# EAGLE design breadboarddev (EAGLE 7.4.0)
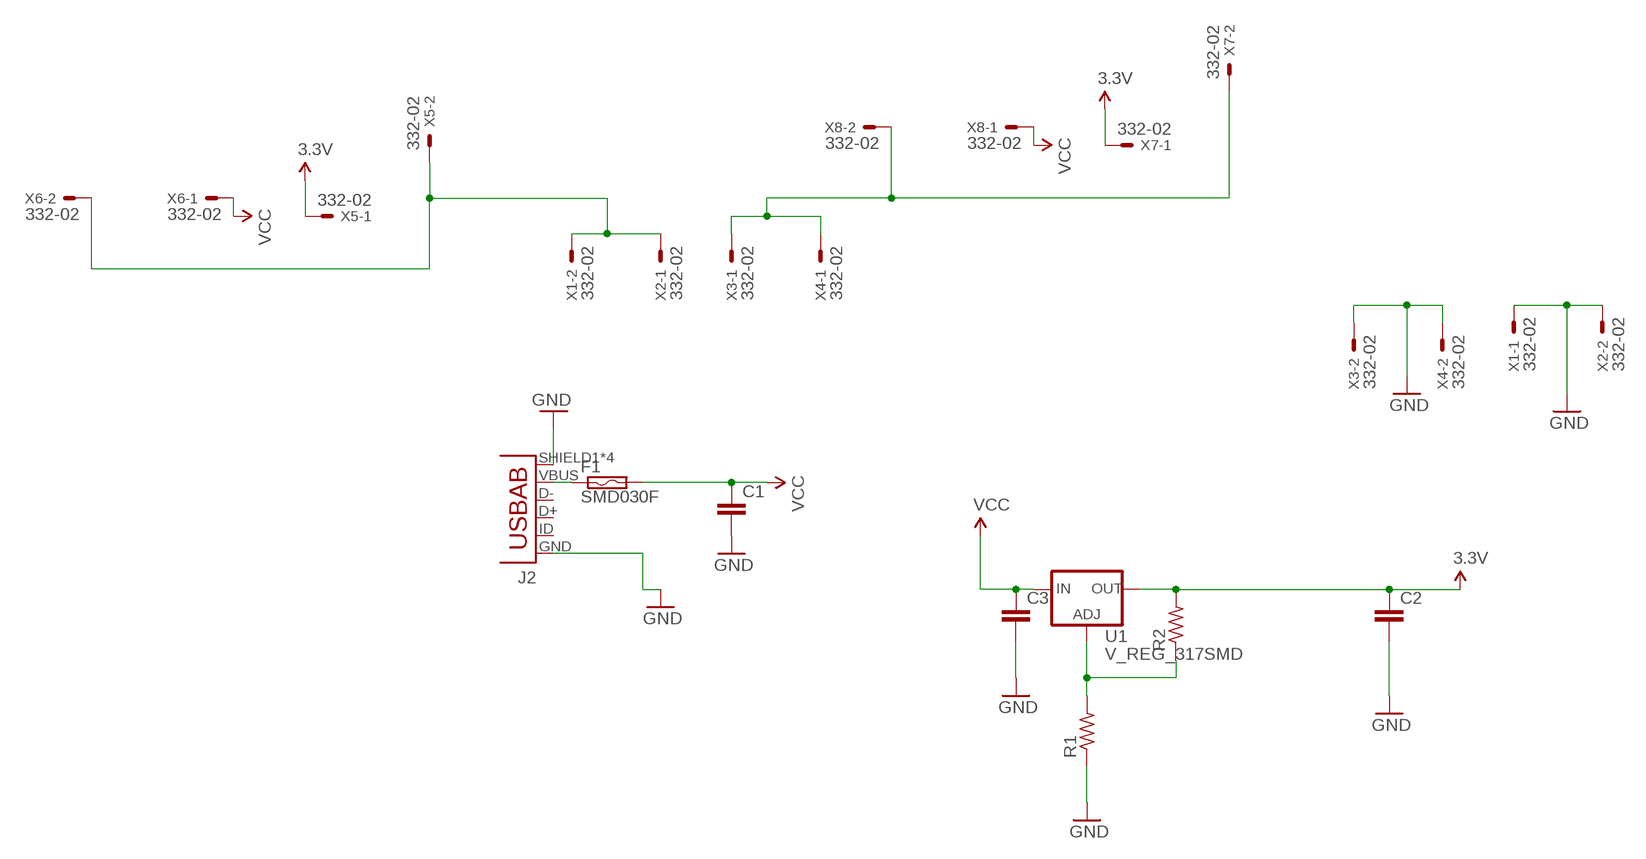
[diagram p0: schematic, sheet 1]

## Parts
C1  C-EUC0603K  [C0603K]
C2  C-EUC0603K  [C0603K]
C3  C-EUC0603K  [C0603K]
F1  SMD030F  [SMD050F]
J2  USB-AB  [USB-AB-MICRO-SMD]
R1  R-US_MELF0204W  [MINI_MELF-0204W]
R2  R-US_MELF0204W  [MINI_MELF-0204W]
U1  V_REG_317SMD  [SOT223]
X1  332-02  [332-02]
X2  332-02  [332-02]
X3  332-02  [332-02]
X4  332-02  [332-02]
X5  332-02  [332-02]
X6  332-02  [332-02]
X7  332-02  [332-02]
X8  332-02  [332-02]

## Nets
3.3V: C2.1 R2.2 U1.2(OUT) X5.1 X7.1
GND: C1.2 C2.2 C3.2 J2.GND J2.SHIELD1(SHIELD) J2.SHIELD2(SHIELD) J2.SHIELD3(SHIELD) J2.SHIELD4(SHIELD) R1.1 X1.1 X2.2 X3.2 X4.2
N$1: R1.2 R2.1 U1.1(ADJ)
N$2: X1.2 X2.1 X5.2 X6.2
N$3: F1.1 J2.VBUS
N$4: X3.1 X4.1 X7.2 X8.2
VCC: C1.1 C3.1 F1.2 U1.3(IN) X6.1 X8.1
Unconnected: J2.D+ J2.D- J2.ID(USBID)

## Library data of the parts
C1-C3 = rcl:C-EU: CAPACITOR, European symbol
F1 = switch-raychem:SMD*F: PolySwitch (TM) Resettable Device Source: Data sheet <http://www.farnell.com/datasheets/13482.pdf>
J2 = SparkFun-Connectors:USB-AB: This is a USB AB connector that is compatible with USB OTG. i.e. this connector can serve as a host or device
R1 R2 = resistor:R-US_: RESISTOR, American symbol
U1 = SparkFun-PowerIC:V_REG_317: Voltage Regulator Standard LM317 adjustable voltage regulator. AOI (Adjust Output Input). Google 'LM317 Calculator' for easy to use app to get the two resistor values needed. 240/720 for 5V output. 240/390 for 3.3V output. Spark Fun Electronics SKU : COM-00527
X1-X8 = con-garry:332-02: 2 Pin - 2mm Dual Row Source: www.mpe-connector.de / garry_shortform_2012.pdf

## Board
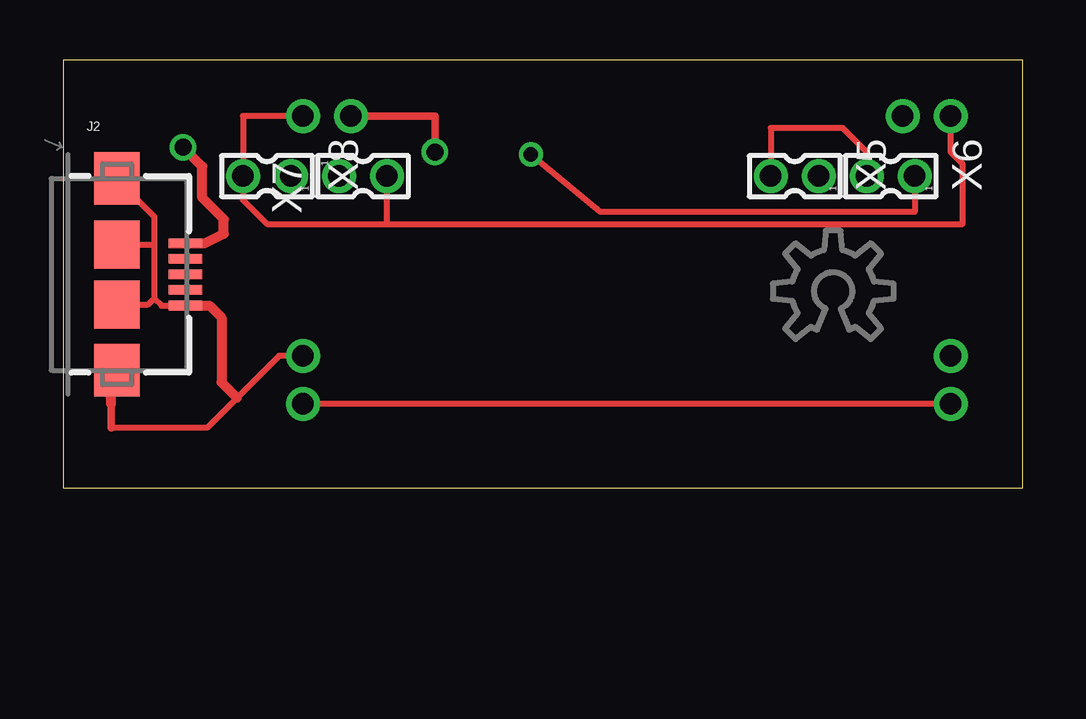
[diagram p1: board, top side]
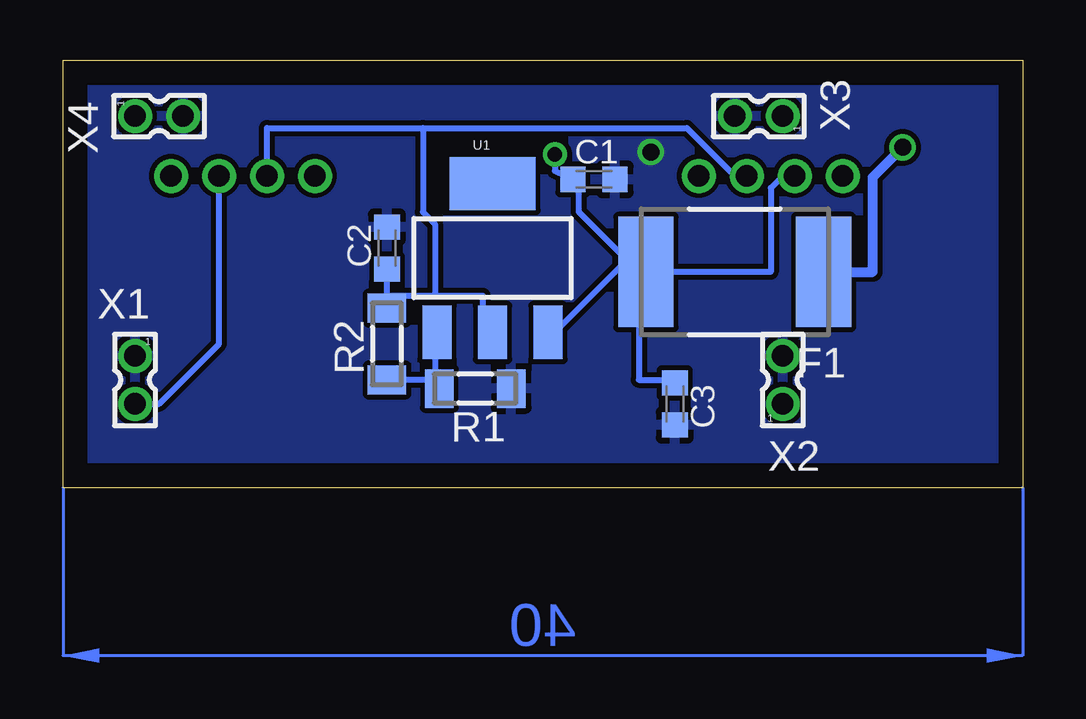
[diagram p2: board, bottom side, seen from below]

Size 40 x 17.84 mm. Coordinates in mm from the lower left corner, seen from the top.
Outline: 0,0 40,0 40,17.84 0,17.84 0,0
Copper layers (1*16): Top 0.035mm / dielectric 1.5mm / Bottom 0.035mm
Design rules "default": minimum track width 10mil, minimum drill 24mil, track to track 8mil, track to pad 8mil, pad to pad 8mil, via to via 8mil, smd to smd 8mil, copper to edge 40mil, drill to drill 8mil, minimum pad ring 10mil, minimum via ring 8mil, stop-mask expansion 4mil, vias tented up to drill 0mil, thermal gap 10mil

### Footprints (pad centres in the part's own frame; a part is rotated, then mirrored left to right if it is on the bottom)
C0603K = smd 1.05 x 1.08: 1 -0.875,0; 2 0.875,0
SMD050F = smd 2.3 x 4.6: 1 -3.7,0; 2 3.7,0
USB-AB-MICRO-SMD = smd 1.4 x 0.4: D+ 2.85,0; D- 2.85,0.65; GND 2.85,-1.3; ID 2.85,-0.65; VBUS 2.85,1.3 | smd 1.9 x 2.2: SHIELD1 0,4; SHIELD4 0,-4 | smd 1.9 x 2: SHIELD2 0,1.25; SHIELD3 0,-1.25
MINI_MELF-0204W = smd 1.2 x 1.6: 1 -1.5,0; 2 1.5,0
SOT223 = smd 1.219 x 2.235: 1 -2.311,-3.099; 2 0,-3.099; 3 2.311,-3.099 | smd 3.6 x 2.2: 4 0,3.099
332-02 = drill 0.9 pad 1.27: 1 0,-1; 2 0,1

### Placement (x,y rotation side)
C1  17.87,12.86 0 bottom
C2  26.5,10 90 bottom
C3  14.5,3.5 270 bottom
F1  12,9 180 bottom
J2  2.25,8.9 0 top
R1  22.82,4.14 180 bottom
R2  26.5,6 90 bottom
U1  22.1,9.58 0 bottom
U$1  [OSHWLOGO_TOL_0.2]  32.1,8.2 0 top
X1  37,4.5 180 bottom
X2  10,4.5 0 bottom
X3  11,15.5 90 bottom
X4  36,15.5 270 bottom
X5  30.5,13 90 top
X6  34.5,13 90 top
X7  12.5,13 270 top
X8  8.5,13 90 top

### Tracks (layer width: path | path; a pad name or v marks a point on that pad's centre or on a via)
3.3V
  Bottom 0.254: 26.5,8 C2.1 | 24.5,8 22.5,8 22.5,6.5 U1.2 | 24.5,8 26.5,8 | 26.5,8 R2.2 | X7.1 12,13 14,15 25,15 | 25,15 31.5,15 X5.1 | 24.5,8 24.5,11 25,11.5 25,15
GND  (via drill 0.7)
  Top 0.254: 2,2.5 6,2.5 7.25,3.75 9,5.5 X2.2 | J2.SHIELD1 2.25,12.85 3.8,11.3 3.8,10.1 | 3.8,10.1 3.8,7.9 | 3.8,7.9 4.1,7.6 J2.GND | J2.SHIELD2 3.75,10.15 3.8,10.1 | J2.SHIELD3 3.55,7.65 3.8,7.9
  Top 0.305: X3.2 15.5,15.5 v15.5,14 | 2,3.5 2,2.5
  Top 0.406: 2,3.5 2,4.65 J2.SHIELD4 | J2.GND 6.1,7.6 6.6,7.1 6.6,4.4 7.25,3.75
  pour Bottom: -2.5,19 -2.5,-2 43.5,-2 43.5,-1.5 43.5,20.5 -2.5,20.5
N$1
  Bottom 0.254: 24.5,4.5 24.5,6 U1.1 | 24.5,4.5 R2.1 | 24.5,4.5 R1.2
N$2
  Top 0.254: X5.2 29.5,15 32.5,15 33.5,14 X6.2 | X1.2 X2.1
  Bottom 0.254: X6.2 33.5,6 36,3.5 X1.2
N$3  (via drill 0.7)
  Top 0.406: J2.VBUS 5.9,10.2 6.7,10.6 6.7,11.2 5.8,12.1 5.8,13.4 v5,14.2
  Bottom 0.406: F1.1 6.25,9 6.25,12.95 v5,14.2
N$4
  Top 0.254: X3.1 7.5,15.5 X8.2 7.5,12 8.5,11 13.5,11 | 13.5,11 X7.2 | X4.1 37,14 37.5,13.5 37.5,11 13.5,11
VCC  (via drill 0.6)
  Top 0.254: X6.1 35.5,11.5 22.4,11.5 v19.5,13.9
  Bottom 0.254: 16,9 16,4.5 14.5,4.5 C3.1 | 16,9 16.5,9.5 | 16.5,9.5 18.5,11.5 18.5,12.5 C1.1 19.5,13.21 v19.5,13.9 | 16,9 F1.2 | 16.5,9.5 19.5,6.5 U1.3 | 16.5,9.5 F1.2 | F1.2 10.5,9 10.5,12.5 10,13 X8.1
(copper drawn outside any net)
  shapes: Bottom area x2

### Text on the board
tValues: V 1.0